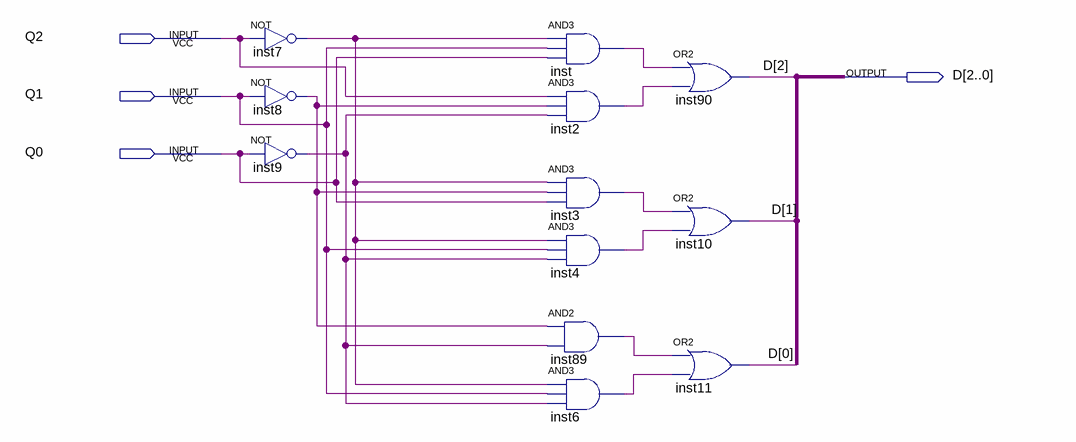
[diagram p0: schematic sheet]
// Quartus schematic TTKT.bdf as structural Verilog: 12 symbols, 4 pins
module TTKT (
  input  Q2,
  input  Q1,
  input  Q0,
  output [2:0] D
);

  wire inst2_out, inst3_out, inst4_out, inst6_out, inst7_out, inst8_out, inst9_out, inst89_out, inst_out;

  not inst7 (inst7_out, Q2);
  not inst8 (inst8_out, Q1);
  not inst9 (inst9_out, Q0);
  and inst (inst_out, inst7_out, Q1, Q0);
  and inst2 (inst2_out, Q2, inst8_out, inst9_out);
  and inst3 (inst3_out, inst7_out, inst8_out, Q0);
  and inst4 (inst4_out, inst7_out, Q1, inst9_out);
  and inst89 (inst89_out, inst8_out, inst9_out);
  and inst6 (inst6_out, inst7_out, Q1, inst9_out);
  or inst90 (D[2], inst_out, inst2_out);
  or inst10 (D[1], inst3_out, inst4_out);
  or inst11 (D[0], inst89_out, inst6_out);
endmodule
